# Altium schematic sheet Sheet1.SchDoc
size A2
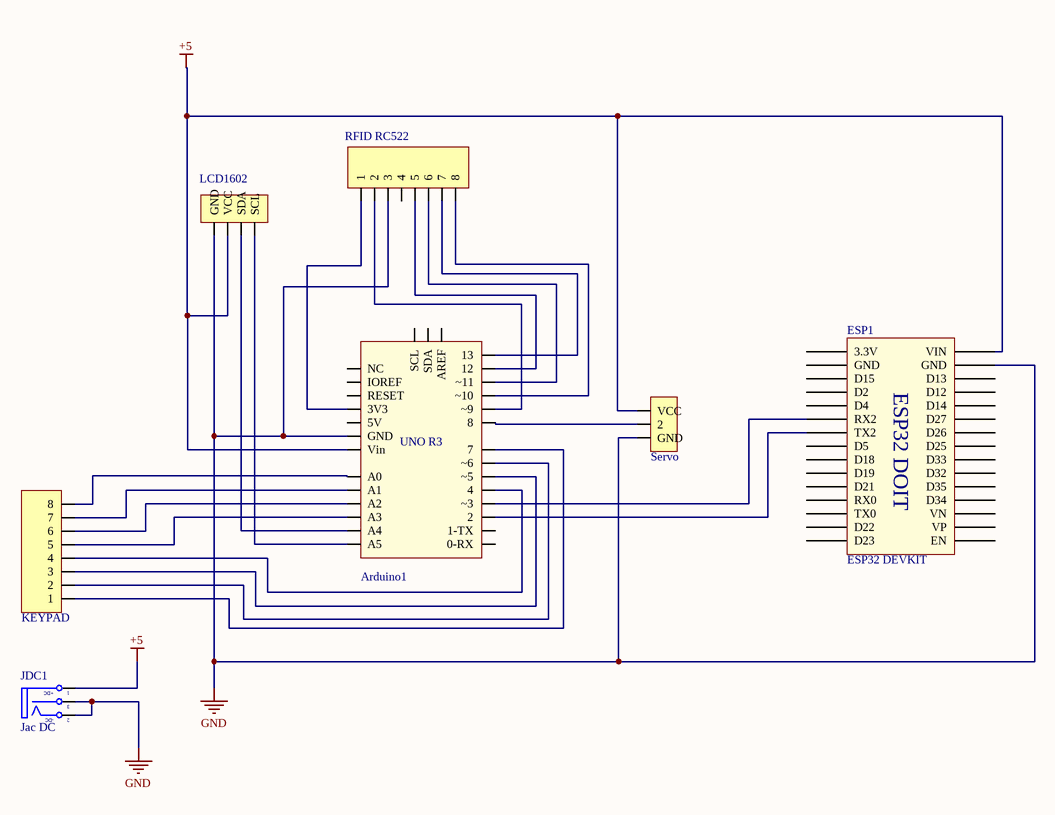
[diagram p0: Sheet1.SchDoc]

## Parts
Arduino1  Arduino Uno R3  [Arduino UNO R3]  (value not drawn)
ESP1  ESP32 DEVKIT  [ESP32 WROOM 32 KIT]
JDC1  Jac DC  [DC-IN]
JP1  RFID RC522  [JP 1x8 CC]
JP2  LCD1602  [JP 1x4 CC]
JP3  Servo  [JP 1x3 DC]
JP4  KEYPAD  [JP 1x8 DC]

## Nets
+5: Arduino1.Vin ESP1.15(VIN) JDC1.1(T) JP2.2(VCC) JP3.1(VCC)
GND: Arduino1.GND ESP1.14(GND) JDC1.2(TN) JDC1.3(S) JP1.3 JP2.1(GND) JP3.3(GND)
NetArduino1_2: Arduino1.2 ESP1.22(TX2)
NetArduino1_3V3: Arduino1.3V3 JP1.1
NetArduino1_4: Arduino1.4 JP4.4
NetArduino1_7: Arduino1.7 JP4.1
NetArduino1_8: Arduino1.8 JP3.2
NetArduino1_12: Arduino1.12 JP1.5
NetArduino1_13: Arduino1.13 JP1.7
NetArduino1_A0: Arduino1.A0 JP4.8
NetArduino1_A1: Arduino1.A1 JP4.7
NetArduino1_A2: Arduino1.A2 JP4.6
NetArduino1_A3: Arduino1.A3 JP4.5
NetArduino1_A4: Arduino1.A4 JP2.3(SDA)
NetArduino1_A5: Arduino1.A5 JP2.4(SCL)
NetArduino1_~3: Arduino1.~3 ESP1.21(RX2)
NetArduino1_~5: Arduino1.~5 JP4.3
NetArduino1_~6: Arduino1.~6 JP4.2
NetArduino1_~9: Arduino1.~9 JP1.2
NetArduino1_~10: Arduino1.~10 JP1.8
NetArduino1_~11: Arduino1.~11 JP1.6

Not connected (* = marked no-connect by the designer): Arduino1 0-RX 1-TX 5V AREF IOREF NC RESET SCL SDA; ESP1 1(EN) 2(VP) 3(VN) 4(D34) 5(D35) 6(D32) 7(D33) 8(D25) 9(D26) 10(D27) 11(D14) 12(D12) 13(D13) 16(3.3V) 17(GND) 18(D15) 19(D2) 20(D4) 23(D5) 24(D18) 25(D19) 26(D21) 27(RX0) 28(TX0) 29(D22) 30(D23); JP1 4

## Notes on the sheet
- (in symbol Arduino Uno R3) UNO R3
- (in symbol DCIN) +DC; -DC
- (in symbol ESP32 WROOM 32 KIT) ESP32 DOIT

## Library data of the parts
Arduino1 = Arduino Uno R3: Value: Cau 1A
ESP1 = ESP32 WROOM 32 KIT
JDC1 = DCIN: Jac DC input; Value: Jac DC
JP1 = JP 1x8 2.54 Cai Cong: Cắm; Ten_Linh_Kien: Jump Đơn Cái 2.54MM 1x40P Cong; Don_Vi: Con; Ma_Hang: MH001265; Ghi_Chu: *; Kieu_Chan: *; Chung_Loai: Cắm
JP2 = JP 1x4 2.54 Cai Cong: Cắm; Ten_Linh_Kien: Jump Đơn Cái 2.54MM 1x40P Cong; Don_Vi: Con; Ma_Hang: MH001265; Ghi_Chu: *; Kieu_Chan: *; Chung_Loai: Cắm
JP3 = JP 1x3 2.54 Duc Cong: Cắm; Ten_Linh_Kien: Jump Đơn Đực 2.54MM 1x40P Cong Đứng; Don_Vi: Con; Ma_Hang: MH000904; Ghi_Chu: *; Kieu_Chan: *; Chung_Loai: Cắm
JP4 = JP 1x8 2.54 Duc Cong: Cắm; Ten_Linh_Kien: Jump Đơn Đực 2.54MM 1x40P Cong Đứng; Don_Vi: Con; Ma_Hang: MH000904; Ghi_Chu: *; Kieu_Chan: *; Chung_Loai: Cắm